# Altium project SaraKit_MainBoard.PrjPcb (part 1 of 3)
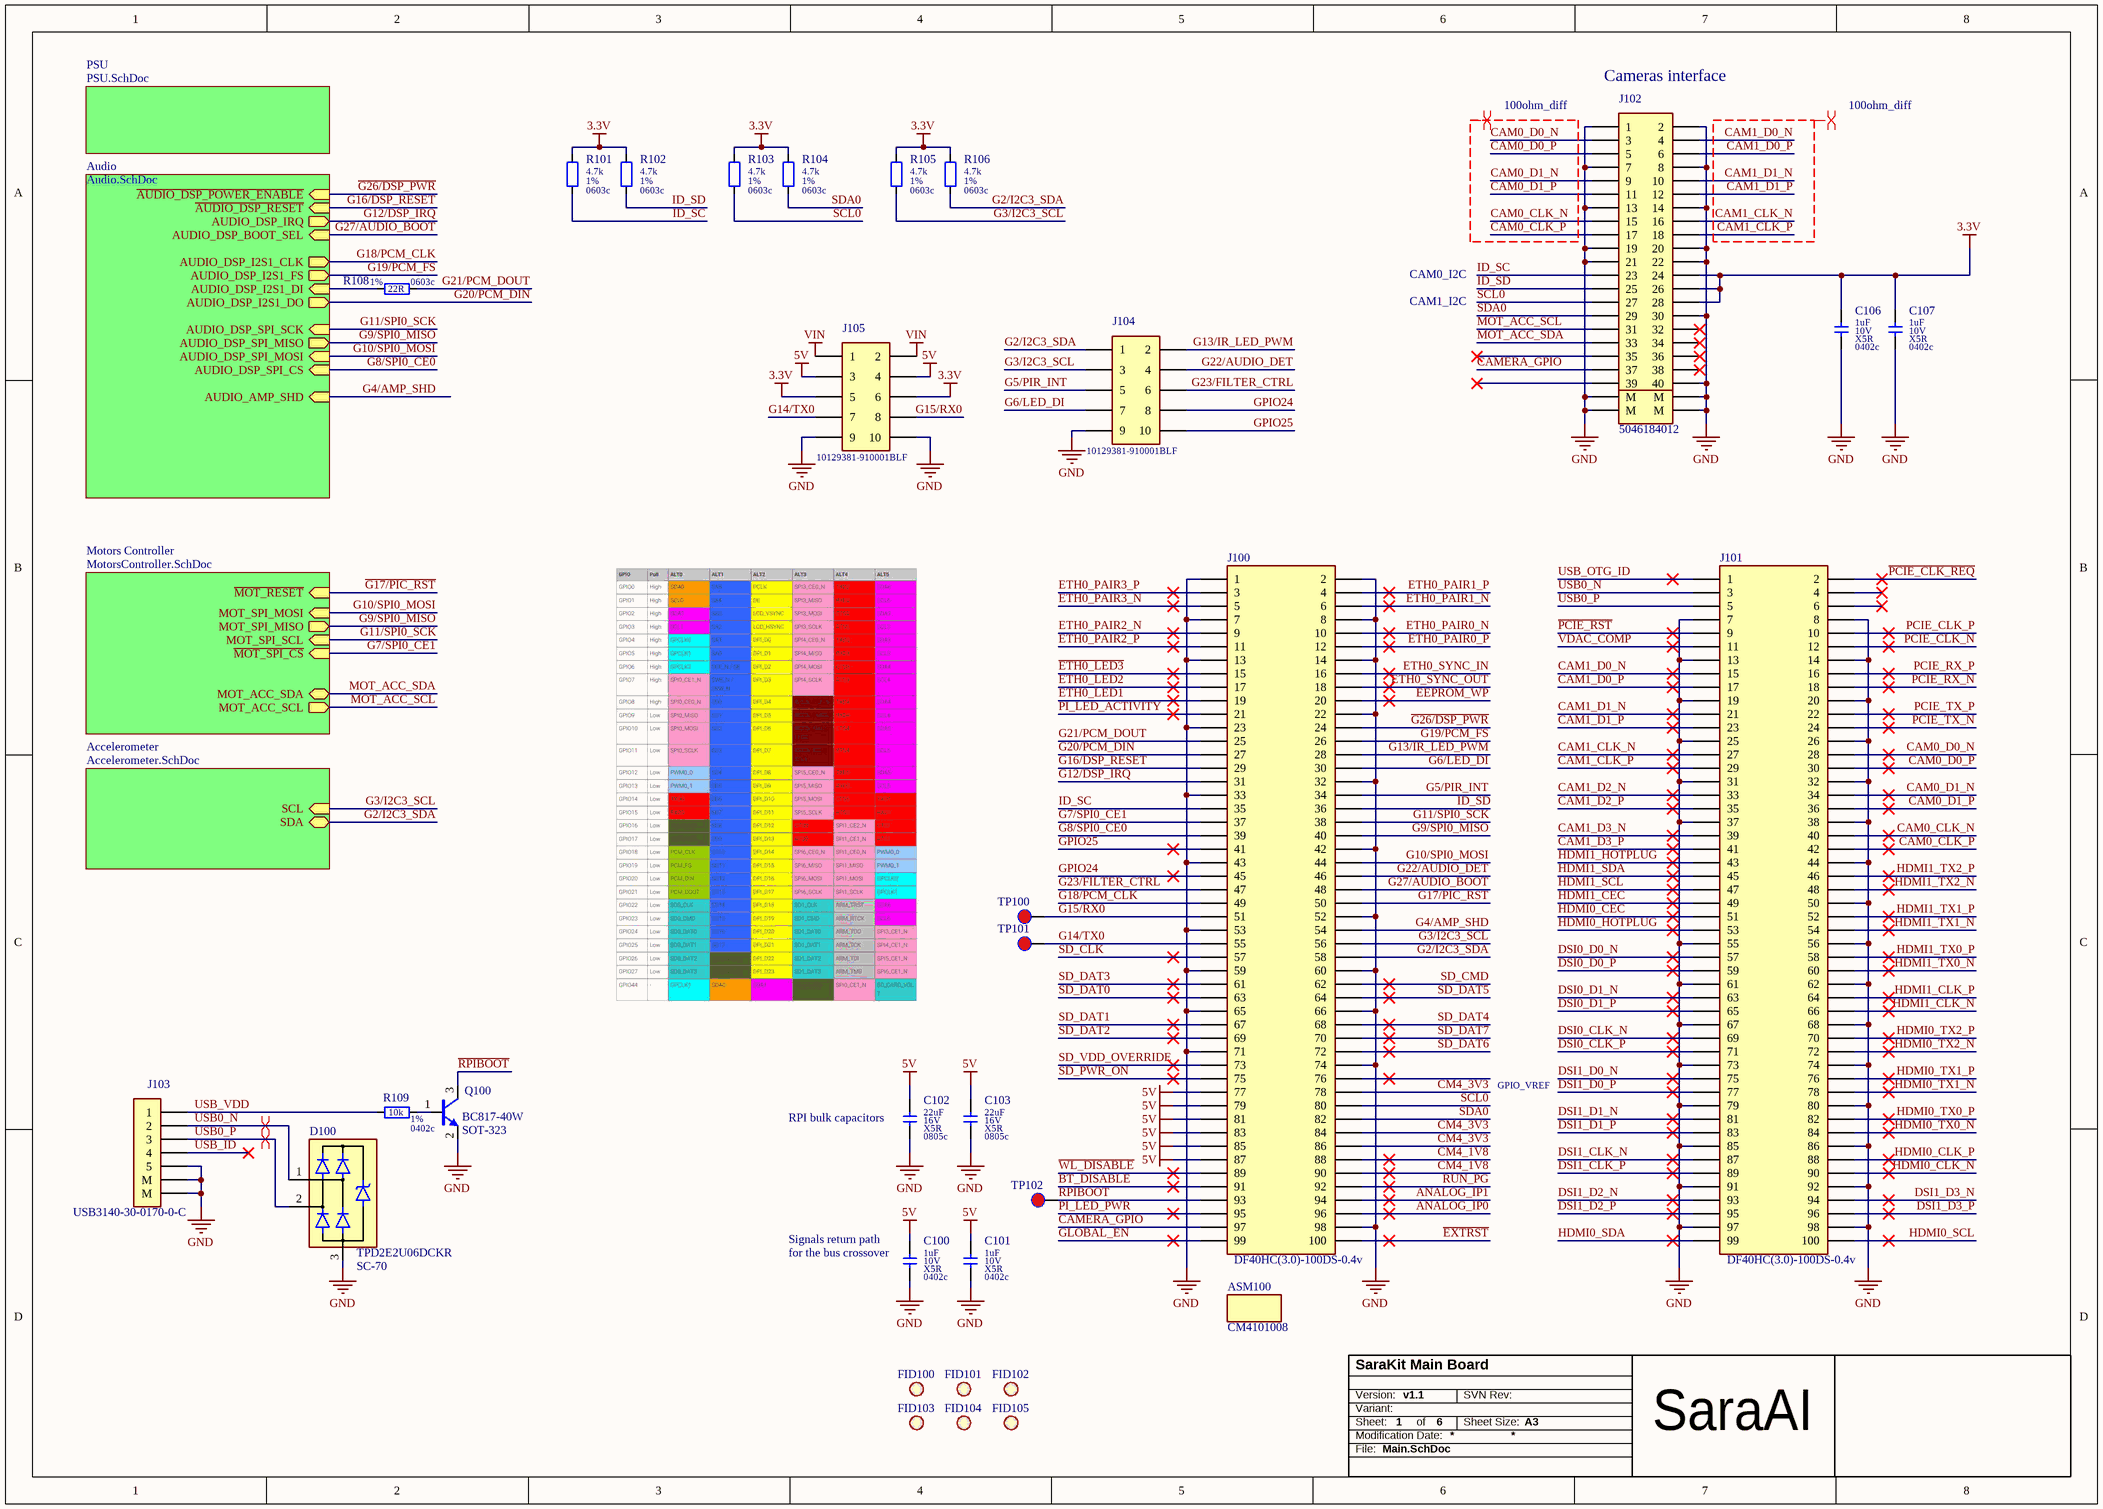
[diagram p0: Main.SchDoc]
Version: v1.1; Project_Code: SaraKit Main Board
6 sheets, 214 parts. Net scope: hierarchical (ports join the sheet entries above them; power ports are global).
Board file: pcb.PcbDoc
Sheets:
  Main.SchDoc
    Audio = Audio.SchDoc
      Speaker Driver = Audio_SpeakerDriver.SchDoc
    Motors Controller = MotorsController.SchDoc
    PSU = PSU.SchDoc
    Accelerometer = Accelerometer.SchDoc

## Sheet Main.SchDoc
size A3; SheetNumber: 1; SheetTotal: 6

### Parts
ASM100  CM4101008  [RASPBERRY PI CM4 EMMC]
C100  11 Parameter 4: X5R  07 Package: 0402c  08 Parameter 1: 1uF  09 Parameter 2: 10V  [CAPC1005X60L]  (hidden comment: CL05A105KP5NNNC)
C101  11 Parameter 4: X5R  07 Package: 0402c  08 Parameter 1: 1uF  09 Parameter 2: 10V  [CAPC1005X60L]  (hidden comment: CL05A105KP5NNNC)
C102  11 Parameter 4: X5R  07 Package: 0805c  08 Parameter 1: 22uF  09 Parameter 2: 16V  [CAPC2013X145L]  (hidden comment: CL21A226MOQNNNE)
C103  11 Parameter 4: X5R  07 Package: 0805c  08 Parameter 1: 22uF  09 Parameter 2: 16V  [CAPC2013X145L]  (hidden comment: CL21A226MOQNNNE)
C106  11 Parameter 4: X5R  07 Package: 0402c  08 Parameter 1: 1uF  09 Parameter 2: 10V  [CAPC1005X60L]  (hidden comment: CL05A105KP5NNNC)
C107  11 Parameter 4: X5R  07 Package: 0402c  08 Parameter 1: 1uF  09 Parameter 2: 10V  [CAPC1005X60L]  (hidden comment: CL05A105KP5NNNC)
D100  07 Package: SC-70  [SOT65P210X110-3L]  (hidden comment: TPD2E2U06DCKR)
FID100  FIDUCIAL  [FIDUCIAL 2MM]  (value not drawn)  (no BOM)
FID101  FIDUCIAL  [FIDUCIAL 2MM]  (value not drawn)  (no BOM)
FID102  FIDUCIAL  [FIDUCIAL 2MM]  (value not drawn)  (no BOM)
FID103  FIDUCIAL  [FIDUCIAL 2MM]  (value not drawn)  (no BOM)
FID104  FIDUCIAL  [FIDUCIAL 2MM]  (value not drawn)  (no BOM)
FID105  FIDUCIAL  [FIDUCIAL 2MM]  (value not drawn)  (no BOM)
J100  DF40HC(3.0)-100DS-0.4v  [DF40HC(3.0)-100DS-0.4V]
J101  DF40HC(3.0)-100DS-0.4v  [DF40HC(3.0)-100DS-0.4V]
J102  5046184012  [MOLEX 5046184012]
J103  USB3140-30-0170-0-C  [USB3140-30-0170-0-C]
J104  10129381-910001BLF  [Goldpin 2.54 2x5]
J105  10129381-910001BLF  [Goldpin 2.54 2x5]
Q100  07 Package: SOT-323  [SOT65P210X110-3L]  (hidden comment: BC817-40W)
R101  07 Package: 0603c  09 Parameter 2: 1%  08 Parameter 1: 4.7k  [RESC1608X55L]  (hidden comment: RC0603FR-074K7L)
R102  07 Package: 0603c  09 Parameter 2: 1%  08 Parameter 1: 4.7k  [RESC1608X55L]  (hidden comment: RC0603FR-074K7L)
R103  07 Package: 0603c  09 Parameter 2: 1%  08 Parameter 1: 4.7k  [RESC1608X55L]  (hidden comment: RC0603FR-074K7L)
R104  07 Package: 0603c  09 Parameter 2: 1%  08 Parameter 1: 4.7k  [RESC1608X55L]  (hidden comment: RC0603FR-074K7L)
R105  07 Package: 0603c  09 Parameter 2: 1%  08 Parameter 1: 4.7k  [RESC1608X55L]  (hidden comment: RC0603FR-074K7L)
R106  07 Package: 0603c  09 Parameter 2: 1%  08 Parameter 1: 4.7k  [RESC1608X55L]  (hidden comment: RC0603FR-074K7L)
R108  07 Package: 0603c  09 Parameter 2: 1%  08 Parameter 1: 22R  [RESC1608X55L]  (hidden comment: RC0603FR-0722RL)
R109  07 Package: 0402c  09 Parameter 2: 1%  08 Parameter 1: 10k  [RESC1005X40L]  (hidden comment: RC0402FR-0710KL)
TP100  TESTPAD  [TP 1.2mm]  (value not drawn)  (no BOM)
TP101  TESTPAD  [TP 1.2mm]  (value not drawn)  (no BOM)
TP102  TESTPAD  [TP 1.2mm]  (value not drawn)  (no BOM)

### Sub-sheets
Accelerometer = Accelerometer.SchDoc: SCL (in), SDA (bidir)
Audio = Audio.SchDoc: AUDIO_DSP_I2S1_CLK (out), AUDIO_DSP_I2S1_FS (out), AUDIO_DSP_I2S1_DI (in), AUDIO_DSP_I2S1_DO (out), AUDIO_DSP_SPI_SCK (in), AUDIO_DSP_SPI_CS (in), AUDIO_AMP_SHD (in), AUDIO_DSP_SPI_MISO (out), AUDIO_DSP_SPI_MOSI (in), ~{AUDIO_DSP_RESET} (in), AUDIO_DSP_BOOT_SEL (in), AUDIO_DSP_IRQ (out), ~{AUDIO_DSP_POWER_ENABLE} (in)
Motors Controller = MotorsController.SchDoc: MOT_ACC_SDA (bidir), MOT_ACC_SCL (out), ~{MOT_RESET} (in), MOT_SPI_SCL (in), ~{MOT_SPI_CS} (in), MOT_SPI_MOSI (in), MOT_SPI_MISO (out)
PSU = PSU.SchDoc: no entries

### Nets
3.3V: C106.2 C107.2 J102.24 J102.26 J102.28 J105.5 J105.6 R101.2 R102.2 R103.2 R104.2 R105.2 R106.2
5V: C100.2 C101.2 C102.2 C103.2 J100.77 J100.79 J100.81 J100.83 J100.85 J100.87 J105.3 J105.4
GND: C100.1 C101.1 C102.1 C103.1 C106.1 C107.1 D100.3 J100.1 J100.2 J100.7 J100.8 J100.13 J100.14 J100.22 J100.23 J100.32 J100.33 J100.42 J100.43 J100.52 J100.53 J100.59 J100.60 J100.65 J100.66 J100.71 J100.74 J100.98 J101.7 J101.8 J101.13 J101.14 J101.19 J101.20 J101.25 J101.26 J101.31 J101.32 J101.37 J101.38 J101.44 J101.50 J101.55 J101.56 J101.61 J101.62 J101.67 J101.68 J101.73 J101.74 J101.79 J101.80 J101.85 J101.86 J101.91 J101.92 J101.97 J101.98 J102.1 J102.2 J102.7 J102.8 J102.13 J102.14 J102.19 J102.20 J102.21 J102.22 J102.30 J102.40 J102.41(M) J102.42(M) J102.43(M) J102.44(M) J103.5 J103.MNT1(M) J103.MNT2(M) J104.9 J105.9 J105.10 Q100.2(E)
VIN: J105.1 J105.2
~{BT_DISABLE}: J100.91
~{EEPROM_WP}: J100.20
~{ETH0_LED1}: J100.19
~{ETH0_LED2}: J100.17
~{ETH0_LED3}: J100.15
~{EXTRST}: J100.100
~{G7/SPI0_CE1}: J100.37 ; sheet Motors Controller/~{MOT_SPI_CS}
~{G8/SPI0_CE0}: J100.39 ; sheet Audio/AUDIO_DSP_SPI_CS
~{G16/DSP_RESET}: J100.29 ; sheet Audio/~{AUDIO_DSP_RESET}
~{G17/PIC_RST}: J100.50 ; sheet Motors Controller/~{MOT_RESET}
~{G26/DSP_PWR}: J100.24 ; sheet Audio/~{AUDIO_DSP_POWER_ENABLE}
~{PCIE_CLK_REQ}: J101.2
~{PCIE_RST}: J101.9
~{PI_LED_ACTIVITY}: J100.21
~{PI_LED_PWR}: J100.95
~{RPIBOOT}: J100.93 Q100.3(C) TP102.1
~{WL_DISABLE}: J100.89
ANALOG_IP0: J100.96
ANALOG_IP1: J100.94
AUDIO_DSP_I2S1_DI: R108.1 ; sheet Audio/AUDIO_DSP_I2S1_DI
CAM0_CLK_N: J101.40 J102.15
CAM0_CLK_P: J101.42 J102.17
CAM0_D0_N: J101.28 J102.3
CAM0_D0_P: J101.30 J102.5
CAM0_D1_N: J101.34 J102.9
CAM0_D1_P: J101.36 J102.11
CAM1_CLK_N: J101.27 J102.16
CAM1_CLK_P: J101.29 J102.18
CAM1_D0_N: J101.15 J102.4
CAM1_D0_P: J101.17 J102.6
CAM1_D1_N: J101.21 J102.10
CAM1_D1_P: J101.23 J102.12
CAM1_D2_N: J101.33
CAM1_D2_P: J101.35
CAM1_D3_N: J101.39
CAM1_D3_P: J101.41
CAMERA_GPIO: J100.97 J102.37
CM4_1V8: J100.88 J100.90
CM4_3V3: J100.78 J100.84 J100.86
DSI0_CLK_N: J101.69
DSI0_CLK_P: J101.71
DSI0_D0_N: J101.57
DSI0_D0_P: J101.59
DSI0_D1_N: J101.63
DSI0_D1_P: J101.65
DSI1_CLK_N: J101.87
DSI1_CLK_P: J101.89
DSI1_D0_N: J101.75
DSI1_D0_P: J101.77
DSI1_D1_N: J101.81
DSI1_D1_P: J101.83
DSI1_D2_N: J101.93
DSI1_D2_P: J101.95
DSI1_D3_N: J101.94
DSI1_D3_P: J101.96
ETH0_PAIR0_N: J100.10
ETH0_PAIR0_P: J100.12
ETH0_PAIR1_N: J100.6
ETH0_PAIR1_P: J100.4
ETH0_PAIR2_N: J100.9
ETH0_PAIR2_P: J100.11
ETH0_PAIR3_N: J100.5
ETH0_PAIR3_P: J100.3
ETH0_SYNC_IN: J100.16
ETH0_SYNC_OUT: J100.18
G2/I2C3_SDA: J100.58 J104.1 R106.1 ; sheet Accelerometer/SDA
G3/I2C3_SCL: J100.56 J104.3 R105.1 ; sheet Accelerometer/SCL
G4/AMP_SHD: J100.54 ; sheet Audio/AUDIO_AMP_SHD
G5/PIR_INT: J100.34 J104.5
G6/LED_DI: J100.30 J104.7
G9/SPI0_MISO: J100.40 ; sheet Audio/AUDIO_DSP_SPI_MISO, sheet Motors Controller/MOT_SPI_MISO
G10/SPI0_MOSI: J100.44 ; sheet Audio/AUDIO_DSP_SPI_MOSI, sheet Motors Controller/MOT_SPI_MOSI
G11/SPI0_SCK: J100.38 ; sheet Audio/AUDIO_DSP_SPI_SCK, sheet Motors Controller/MOT_SPI_SCL
G12/DSP_IRQ: J100.31 ; sheet Audio/AUDIO_DSP_IRQ
G13/IR_LED_PWM: J100.28 J104.2
G14/TX0: J100.55 J105.7 TP101.1
G15/RX0: J100.51 J105.8 TP100.1
G18/PCM_CLK: J100.49 ; sheet Audio/AUDIO_DSP_I2S1_CLK
G19/PCM_FS: J100.26 ; sheet Audio/AUDIO_DSP_I2S1_FS
G20/PCM_DIN: J100.27 ; sheet Audio/AUDIO_DSP_I2S1_DO
G21/PCM_DOUT: J100.25 R108.2
G22/AUDIO_DET: J100.46 J104.4
G23/FILTER_CTRL: J100.47 J104.6
G27/AUDIO_BOOT: J100.48 ; sheet Audio/AUDIO_DSP_BOOT_SEL
GLOBAL_EN: J100.99
GPIO24: J100.45 J104.8
GPIO25: J100.41 J104.10
HDMI0_CEC: J101.51
HDMI0_CLK_N: J101.90
HDMI0_CLK_P: J101.88
HDMI0_HOTPLUG: J101.53
HDMI0_SCL: J101.100
HDMI0_SDA: J101.99
HDMI0_TX0_N: J101.84
HDMI0_TX0_P: J101.82
HDMI0_TX1_N: J101.78
HDMI0_TX1_P: J101.76
HDMI0_TX2_N: J101.72
HDMI0_TX2_P: J101.70
HDMI1_CEC: J101.49
HDMI1_CLK_N: J101.66
HDMI1_CLK_P: J101.64
HDMI1_HOTPLUG: J101.43
HDMI1_SCL: J101.47
HDMI1_SDA: J101.45
HDMI1_TX0_N: J101.60
HDMI1_TX0_P: J101.58
HDMI1_TX1_N: J101.54
HDMI1_TX1_P: J101.52
HDMI1_TX2_N: J101.48
HDMI1_TX2_P: J101.46
ID_SC: J100.35 J102.23 R101.1
ID_SD: J100.36 J102.25 R102.1
MOT_ACC_SCL: J102.31 ; sheet Motors Controller/MOT_ACC_SCL
MOT_ACC_SDA: J102.33 ; sheet Motors Controller/MOT_ACC_SDA
PCIE_CLK_N: J101.12
PCIE_CLK_P: J101.10
PCIE_RX_N: J101.18
PCIE_RX_P: J101.16
PCIE_TX_N: J101.24
PCIE_TX_P: J101.22
RUN_PG: J100.92
SCL0: J100.80 J102.27 R103.1
SD_CLK: J100.57
SD_CMD: J100.62
SD_DAT0: J100.63
SD_DAT1: J100.67
SD_DAT2: J100.69
SD_DAT3: J100.61
SD_DAT4: J100.68
SD_DAT5: J100.64
SD_DAT6: J100.72
SD_DAT7: J100.70
SD_PWR_ON: J100.75
SD_VDD_OVERRIDE: J100.73
SDA0: J100.82 J102.29 R104.1
USB0_N: D100.1 J101.3 J103.2
USB0_P: D100.2 J101.5 J103.3
USB_ID: J103.4
USB_OTG_ID: J101.1
USB_VDD: J103.1 R109.2
VDAC_COMP: J101.11
NetQ100_1: Q100.1(B) R109.1

Not connected (* = marked no-connect by the designer): J100 76*; J101 4* 6*; J102 32* 34* 35* 36* 38* 39*

### Layout directives
differential pair; differential pair class 100ohm_diff: CAM0_CLK_N, CAM0_CLK_P, CAM0_D0_N, CAM0_D0_P, CAM0_D1_N, CAM0_D1_P, CAM1_CLK_N, CAM1_CLK_P, CAM1_D0_N, CAM1_D0_P, CAM1_D1_N, CAM1_D1_P
differential pair; differential pair class USB: USB0_N, USB0_P

### Notes on the sheet
- (near J102) Cameras interface
- CAM0_I2C
- CAM1_I2C
- (near C102) RPI bulk capacitors
- GPIO_VREF
- (near C100) Signals return path
- (near C100) for the bus crossover
- Version:
- SVN Rev:
- Sheet:
- File:
- Modification Date:
- Variant:
- of
- Sheet Size:
- A3
- SaraAI

### Library data of the parts
ASM100 = 439: FAS SoM 1GB 8GB; 03 Manufacturer: Raspberry Pi; 00 Index: 439; 01 Name: IC PROCESSOR CM4101008 Raspberry Pi; 04 Main Group: IC; 05 Sub Group: PROCESSOR; 06 Assembly: FAS; 11 Parameter 4: SoM; 12 Parameter 5: 1GB; 13 Parameter 6: 8GB; 14 Modification Date: 08.02.2021; ComponentLink1Description: DATASHEET; ComponentLink1URL: https://datasheets.raspberrypi.org/cm4/cm4-datasheet.pdf; 02 MPN: CM4101008
C100 C101 C106 C107 = 154: SMT 0402c 1uF 10V 10% X5R 10.2MHz 85'C; 03 Manufacturer: Samsung; 00 Index: 154; 01 Name: CAPACITOR THICK FILM CL05A105KP5NNNC Samsung; 05 Sub Group: THICK FILM; 04 Main Group: CAPACITOR; 06 Assembly: SMT; 12 Parameter 5: 10.2MHz; 13 Parameter 6: 85'C; 14 Modification Date: 16.11.2020; ComponentLink1Description: DATASHEET; ComponentLink1URL: E:\Praca\Mindsailors\Mindsailors Altium\Database Library\Datasheets\CAPACITOR\Samsung CL05A105KP5NNNC.pdf; 02 MPN: CL05A105KP5NNNC; 10 Parameter 3: 10%
C102 C103 = 81: SMT 0805c 22uF 16V 20% X5R 1.6MHz 85'C; 03 Manufacturer: Samsung; 00 Index: 81; 01 Name: CAPACITOR CERAMIC CL21A226MOQNNNE Samsung; 05 Sub Group: CERAMIC; 04 Main Group: CAPACITOR; 06 Assembly: SMT; 12 Parameter 5: 1.6MHz; 13 Parameter 6: 85'C; 14 Modification Date: 16.11.2020; ComponentLink1Description: DATASHEET; ComponentLink1URL: E:\Praca\Mindsailors\Mindsailors Altium\Database Library\Datasheets\CAPACITOR\Samsung CL21A226MOQNNN.pdf; 02 MPN: CL21A226MOQNNNE; 10 Parameter 3: 20%
D100 = 445: SMT SC-70 6.5V 5.5A 85W Bidirectional 12.4V 10nA; 03 Manufacturer: Texas Instruments; 00 Index: 445; 01 Name: DIODE TVS/ESD TPD2E2U06DCKR Texas Instruments; 04 Main Group: DIODE; 05 Sub Group: TVS/ESD; Library Directory: sym_basics/; Fotprint Directory: fot_ipc/; 06 Assembly: SMT; 11 Parameter 4: Bidirectional; 12 Parameter 5: 12.4V; 13 Parameter 6: 10nA; 14 Modification Date: 10.02.2021; ComponentLink1Description: DATASHEET; ComponentLink1URL: https://www.ti.com/lit/ds/symlink/tpd2e2u06.pdf?ts=1612947447411&ref_url=https%253A%252F%252Fwww.ti.com%252Fsitesearch%252Fdocs%252Funiversalsearch.tsp%253FsearchTerm%253DTPD2E2U06; 10 Parameter 3: 85W; 09 Parameter 2: 5.5A; 08 Parameter 1: 6.5V; 02 MPN: TPD2E2U06DCKR
FID100-FID105 = 487: 00 Index: 487; 01 Name: FIDUCIAL; 14 Modification Date: 23.01.2021; 02 MPN: FIDUCIAL; 07 Package: *
J100 J101 = 440: SMT 2x50 0.4mm Female Straight; 03 Manufacturer: Hirose; 00 Index: 440; 01 Name: CONNECTOR PCB DF40HC(3.0)-100DS-0.4v Hirose; 04 Main Group: CONNECTOR; 05 Sub Group: PCB; 06 Assembly: SMT; 14 Modification Date: 08.02.2021; ComponentLink1Description: DATASHEET; ComponentLink1URL: https://www.hirose.com/en/product/document?clcode=CL0684-4151-0-51&productname=DF40HC(3.0)-100DS-0.4V(51&series=DF40&documenttype=2DDrawing&lang=en&documentid=0001001369; 10 Parameter 3: Female; 09 Parameter 2: 0.4mm; 08 Parameter 1: 2x50; 11 Parameter 4: Straight; 02 MPN: DF40HC(3.0)-100DS-0.4v; 07 Package: *
J102 = 509: SMT 2x20 0.35mm Straight 50V 0.3A; 03 Manufacturer: Molex; 00 Index: 509; 01 Name: CONNECTOR PCB 5046184012 Molex; 04 Main Group: CONNECTOR; 05 Sub Group: PCB; 06 Assembly: SMT; 13 Parameter 6: 0.3A; 14 Modification Date: 18.03.2021; ComponentLink1Description: DATASHEET; ComponentLink1URL: https://www.molex.com/molex/products/part-detail/pcb_receptacles/5046183012; 09 Parameter 2: 0.35mm; 08 Parameter 1: 2x20; 11 Parameter 4: Straight; 12 Parameter 5: 50V; 07 Package: *; 02 MPN: 5046184012
J103 = 980: SMD/THT USB 0.65mm Straight 30V 1A; 03 Manufacturer: GCT; 00 Index: 980; 01 Name: CONNECTOR WIRE USB3140-30-0170-0-C GCT; 04 Main Group: CONNECTOR; 05 Sub Group: WIRE; Library Directory: sym_basics/; Fotprint Directory: fot_other/; 06 Assembly: SMD/THT; 13 Parameter 6: 1A; 14 Modification Date: 05.01.2022; ComponentLink1Description: DATASHEET; ComponentLink1URL: https://pl.mouser.com/datasheet/2/837/USB3140-1948849.pdf; 09 Parameter 2: 0.65mm; 08 Parameter 1: USB; 11 Parameter 4: Straight; 12 Parameter 5: 30V; 07 Package: *; 02 MPN: USB3140-30-0170-0-C
J104 J105 = 981: THT 2X5 2.54mm Straight 110V 3A; 03 Manufacturer: Amphenol; 00 Index: 981; 01 Name: CONNECTOR WIRE 10129381-910001BLF Amphenol; 04 Main Group: CONNECTOR; 05 Sub Group: WIRE; Library Directory: sym_basics/; Fotprint Directory: fot_other/; 06 Assembly: THT; 13 Parameter 6: 3A; 14 Modification Date: 05.01.2022; ComponentLink1Description: DATASHEET; ComponentLink1URL: https://www.amphenol-icc.com/econostik-10129381910001blf.html; 09 Parameter 2: 2.54mm; 08 Parameter 1: 2X5; 11 Parameter 4: Straight; 12 Parameter 5: 110V; 07 Package: *; 02 MPN: 10129381-910001BLF
Q100 = 93: SMT SOT-323 NPN 45V 0.5A 0.2W; 03 Manufacturer: Nexperia; 00 Index: 93; 01 Name: TRANSISTOR BIPOLAR BC817-40W Nexperia; 04 Main Group: TRANSISTOR; 05 Sub Group: BIPOLAR; Library Directory: sym_basics/; Fotprint Directory: fot_ipc/; 06 Assembly: SMT; 13 Parameter 6: 0.2W; 14 Modification Date: 16.11.2020; ComponentLink1Description: DATASHEET; ComponentLink1URL: E:\Praca\Mindsailors\Mindsailors Altium\Database Library\Datasheets\TRANSISTOR\Nexperia BC817W Series.pdf; 08 Parameter 1: NPN; 11 Parameter 4: 45V; 12 Parameter 5: 0.5A; 02 MPN: BC817-40W
R101-R106 = 380: SMT 0603c 4.7k 1% 100mW 100ppm/K 75V; 03 Manufacturer: Yageo; 00 Index: 380; 01 Name: RESISTOR THICK FILM RC0603FR-074K7L Yageo; 05 Sub Group: THICK FILM; 04 Main Group: RESISTOR; 06 Assembly: SMT; 11 Parameter 4: 100ppm/K; 12 Parameter 5: 75V; 14 Modification Date: 25.01.2021; ComponentLink1Description: DATASHEET; ComponentLink1URL: https://www.yageo.com/upload/media/product/products/datasheet/rchip/PYu-RC_Group_51_RoHS_L_11.pdf; 10 Parameter 3: 100mW; 02 MPN: RC0603FR-074K7L
R108 = 318: SMT 0603c 22R 1% 100mW 100ppm/K 75V; 03 Manufacturer: Yageo; 00 Index: 318; 01 Name: RESISTOR THICK FILM RC0603FR-0722RL Yageo; 05 Sub Group: THICK FILM; Library Directory: sym_basics/; Fotprint Directory: fot_ipc/; 04 Main Group: RESISTOR; 06 Assembly: SMT; 11 Parameter 4: 100ppm/K; 12 Parameter 5: 75V; 14 Modification Date: 25.01.2021; ComponentLink1Description: DATASHEET; ComponentLink1URL: https://www.yageo.com/upload/media/product/products/datasheet/rchip/PYu-RC_Group_51_RoHS_L_11.pdf; 10 Parameter 3: 100mW; 02 MPN: RC0603FR-0722RL
R109 = 15: SMT 0402c 10k 1% 62.5mW 100ppm/K 50V; 03 Manufacturer: Yageo; 00 Index: 15; 01 Name: RESISTOR THICK FILM RC0402FR-0710KL Yageo; 05 Sub Group: THICK FILM; 04 Main Group: RESISTOR; 06 Assembly: SMT; 11 Parameter 4: 100ppm/K; 12 Parameter 5: 50V; 14 Modification Date: 16.11.2020; ComponentLink1Description: DATASHEET; ComponentLink1URL: E:\Praca\Mindsailors\Mindsailors Altium\Database Library\Datasheets\RESISTOR\Yageo RC_L Series.pdf; 10 Parameter 3: 62.5mW; 02 MPN: RC0402FR-0710KL
TP100 = 10: 00 Index: 10; 01 Name: PCB COMPONENT TESTPAD TESTPAD; 04 Main Group: PCB COMPONENT; Library Directory: sym_basics/; Fotprint Directory: fot_other/; 02 MPN: TESTPAD; 05 Sub Group: TESTPAD; 14 Modification Date: 16.11.2020
TP101 TP102 = 10: 00 Index: 10; 01 Name: PCB COMPONENT TESTPAD TESTPAD; 04 Main Group: PCB COMPONENT; 02 MPN: TESTPAD; 05 Sub Group: TESTPAD; 14 Modification Date: 16.11.2020

## Sheet Audio.SchDoc
size A3; SheetNumber: 2; SheetTotal: 6
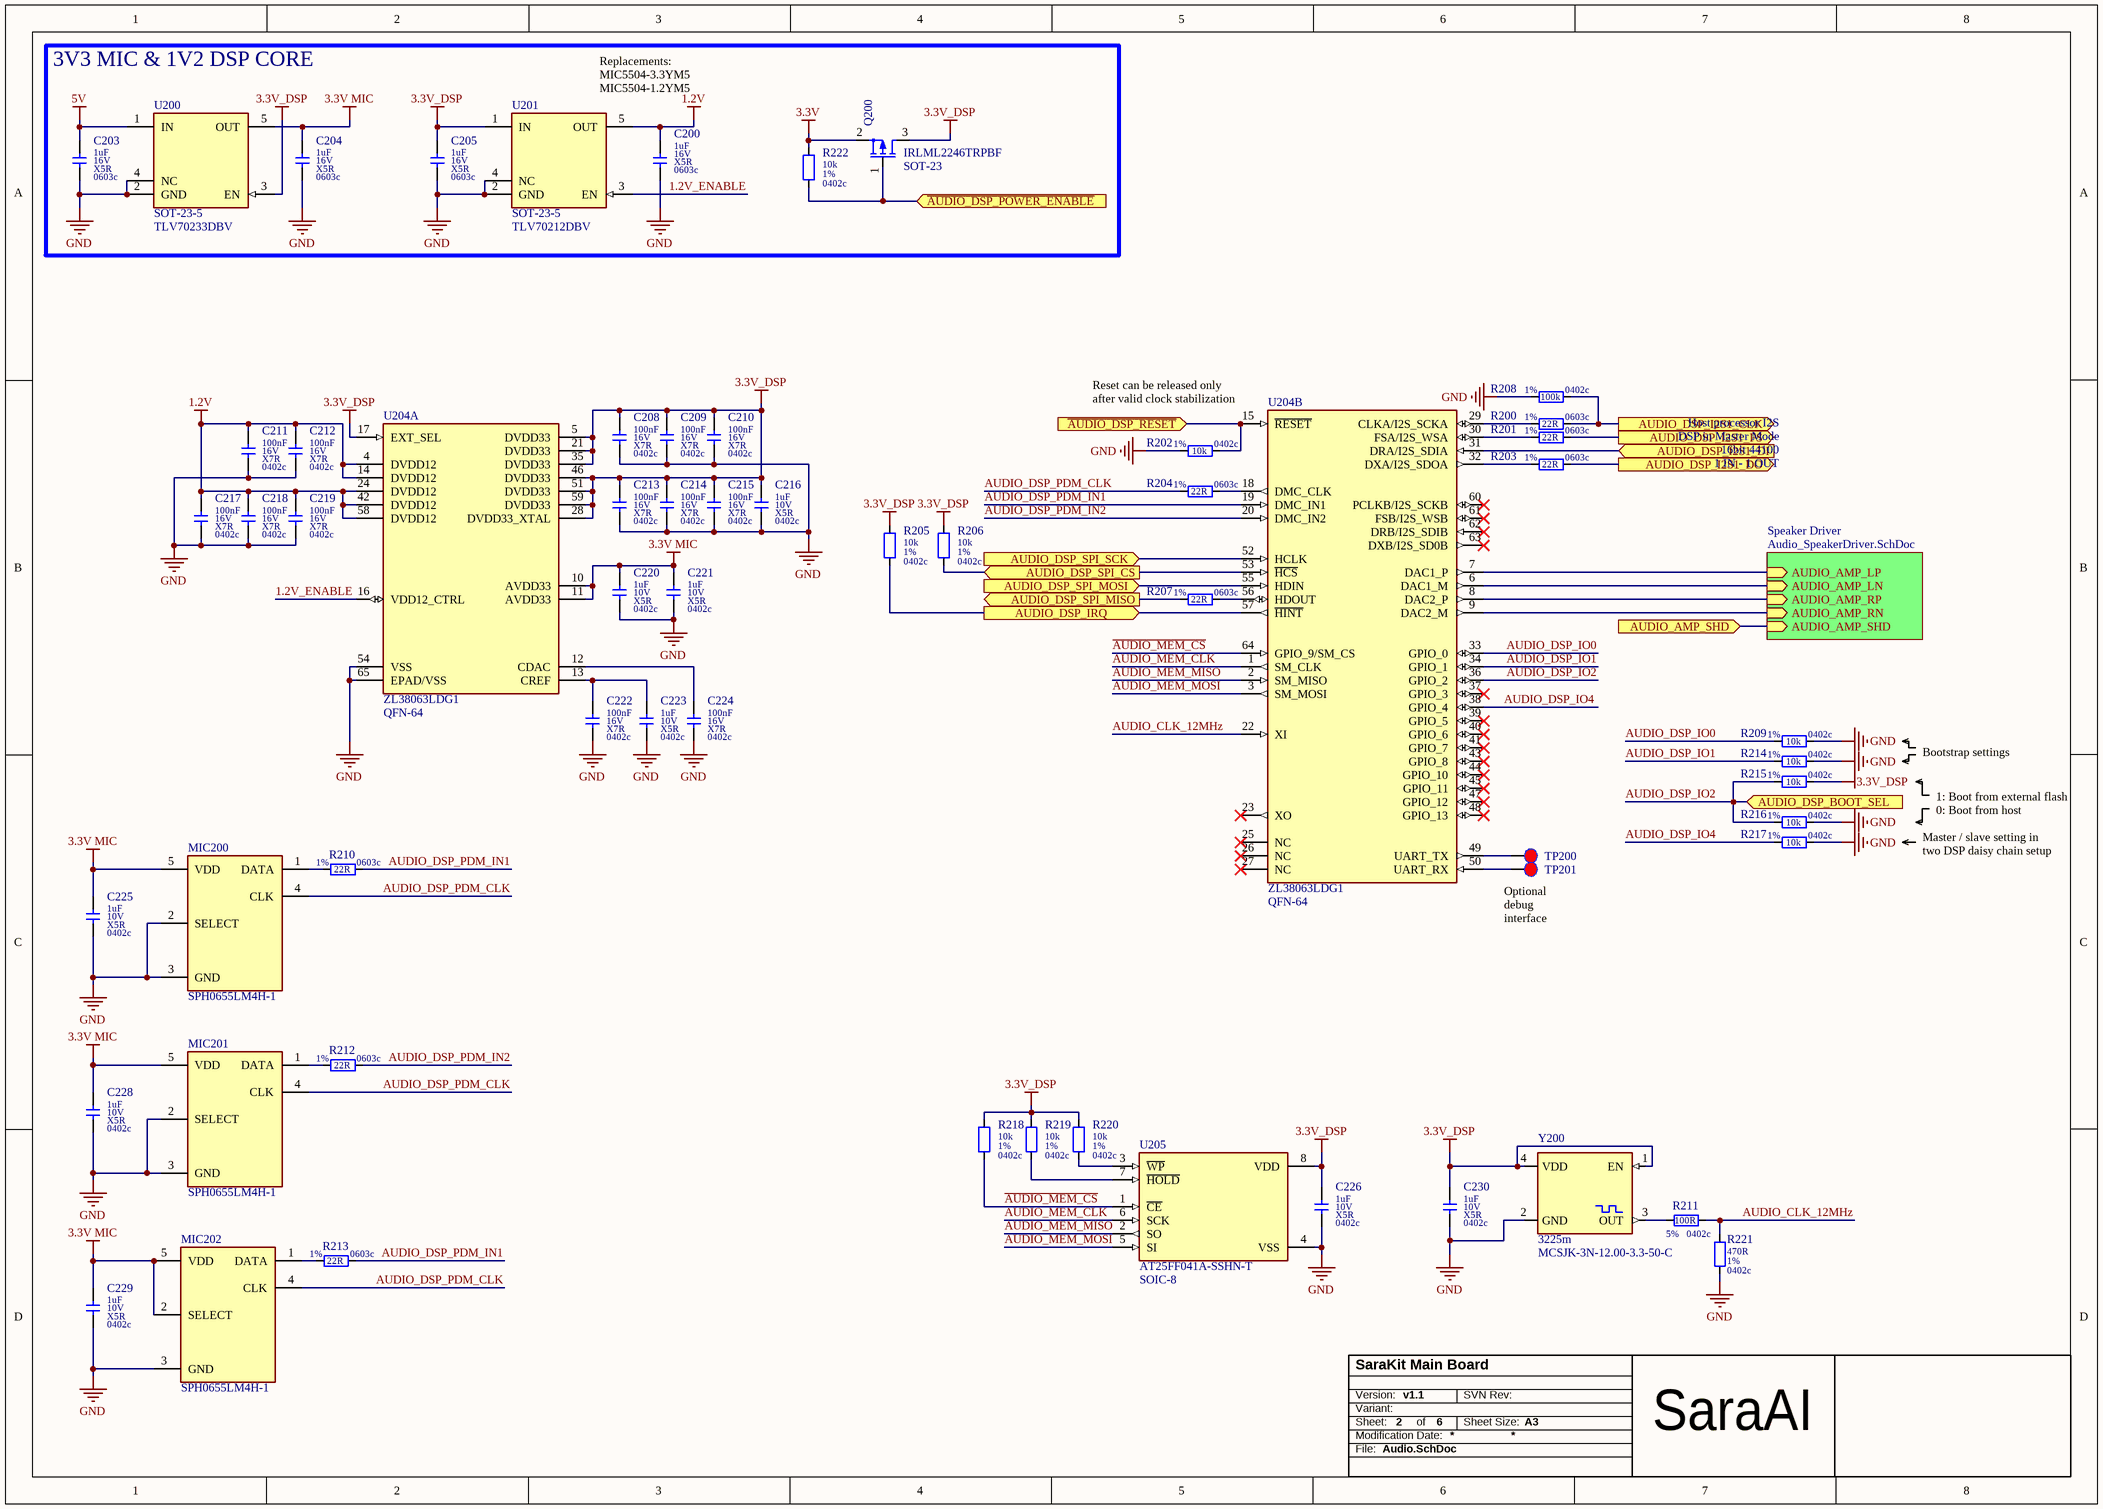
[diagram p1: Audio.SchDoc]

### Parts
C200  11 Parameter 4: X5R  07 Package: 0603c  08 Parameter 1: 1uF  09 Parameter 2: 16V  [CAPC1608X90L]  (hidden comment: CL10A105KO8NNNC)
C203  11 Parameter 4: X5R  07 Package: 0603c  08 Parameter 1: 1uF  09 Parameter 2: 16V  [CAPC1608X90L]  (hidden comment: CL10A105KO8NNNC)
C204  11 Parameter 4: X5R  07 Package: 0603c  08 Parameter 1: 1uF  09 Parameter 2: 16V  [CAPC1608X90L]  (hidden comment: CL10A105KO8NNNC)
C205  11 Parameter 4: X5R  07 Package: 0603c  08 Parameter 1: 1uF  09 Parameter 2: 16V  [CAPC1608X90L]  (hidden comment: CL10A105KO8NNNC)
C208  11 Parameter 4: X7R  07 Package: 0402c  08 Parameter 1: 100nF  09 Parameter 2: 16V  [CAPC1005X60L]  (hidden comment: CL05B104KO5NNNC)
C209  11 Parameter 4: X7R  07 Package: 0402c  08 Parameter 1: 100nF  09 Parameter 2: 16V  [CAPC1005X60L]  (hidden comment: CL05B104KO5NNNC)
C210  11 Parameter 4: X7R  07 Package: 0402c  08 Parameter 1: 100nF  09 Parameter 2: 16V  [CAPC1005X60L]  (hidden comment: CL05B104KO5NNNC)
C211  11 Parameter 4: X7R  07 Package: 0402c  08 Parameter 1: 100nF  09 Parameter 2: 16V  [CAPC1005X60L]  (hidden comment: CL05B104KO5NNNC)
C212  11 Parameter 4: X7R  07 Package: 0402c  08 Parameter 1: 100nF  09 Parameter 2: 16V  [CAPC1005X60L]  (hidden comment: CL05B104KO5NNNC)
C213  11 Parameter 4: X7R  07 Package: 0402c  08 Parameter 1: 100nF  09 Parameter 2: 16V  [CAPC1005X60L]  (hidden comment: CL05B104KO5NNNC)
C214  11 Parameter 4: X7R  07 Package: 0402c  08 Parameter 1: 100nF  09 Parameter 2: 16V  [CAPC1005X60L]  (hidden comment: CL05B104KO5NNNC)
C215  11 Parameter 4: X7R  07 Package: 0402c  08 Parameter 1: 100nF  09 Parameter 2: 16V  [CAPC1005X60L]  (hidden comment: CL05B104KO5NNNC)
C216  11 Parameter 4: X5R  07 Package: 0402c  08 Parameter 1: 1uF  09 Parameter 2: 10V  [CAPC1005X60L]  (hidden comment: CL05A105KP5NNNC)
C217  11 Parameter 4: X7R  07 Package: 0402c  08 Parameter 1: 100nF  09 Parameter 2: 16V  [CAPC1005X60L]  (hidden comment: CL05B104KO5NNNC)
C218  11 Parameter 4: X7R  07 Package: 0402c  08 Parameter 1: 100nF  09 Parameter 2: 16V  [CAPC1005X60L]  (hidden comment: CL05B104KO5NNNC)
C219  11 Parameter 4: X7R  07 Package: 0402c  08 Parameter 1: 100nF  09 Parameter 2: 16V  [CAPC1005X60L]  (hidden comment: CL05B104KO5NNNC)
C220  11 Parameter 4: X5R  07 Package: 0402c  08 Parameter 1: 1uF  09 Parameter 2: 10V  [CAPC1005X60L]  (hidden comment: CL05A105KP5NNNC)
C221  11 Parameter 4: X5R  07 Package: 0402c  08 Parameter 1: 1uF  09 Parameter 2: 10V  [CAPC1005X60L]  (hidden comment: CL05A105KP5NNNC)
C222  11 Parameter 4: X7R  07 Package: 0402c  08 Parameter 1: 100nF  09 Parameter 2: 16V  [CAPC1005X60L]  (hidden comment: CL05B104KO5NNNC)
C223  11 Parameter 4: X5R  07 Package: 0402c  08 Parameter 1: 1uF  09 Parameter 2: 10V  [CAPC1005X60L]  (hidden comment: CL05A105KP5NNNC)
C224  11 Parameter 4: X7R  07 Package: 0402c  08 Parameter 1: 100nF  09 Parameter 2: 16V  [CAPC1005X60L]  (hidden comment: CL05B104KO5NNNC)
C225  11 Parameter 4: X5R  07 Package: 0402c  08 Parameter 1: 1uF  09 Parameter 2: 10V  [CAPC1005X60L]  (hidden comment: CL05A105KP5NNNC)
C226  11 Parameter 4: X5R  07 Package: 0402c  08 Parameter 1: 1uF  09 Parameter 2: 10V  [CAPC1005X60L]  (hidden comment: CL05A105KP5NNNC)
C228  11 Parameter 4: X5R  07 Package: 0402c  08 Parameter 1: 1uF  09 Parameter 2: 10V  [CAPC1005X60L]  (hidden comment: CL05A105KP5NNNC)
C229  11 Parameter 4: X5R  07 Package: 0402c  08 Parameter 1: 1uF  09 Parameter 2: 10V  [CAPC1005X60L]  (hidden comment: CL05A105KP5NNNC)
C230  11 Parameter 4: X5R  07 Package: 0402c  08 Parameter 1: 1uF  09 Parameter 2: 10V  [CAPC1005X60L]  (hidden comment: CL05A105KP5NNNC)
MIC200  SPH0655LM4H-1  [KNOWLES SPH0655LM4H-1]
MIC201  SPH0655LM4H-1  [KNOWLES SPH0655LM4H-1]
MIC202  SPH0655LM4H-1  [KNOWLES SPH0655LM4H-1]
Q200  07 Package: SOT-23  [SOT95P240X110-3L]  (hidden comment: IRLML2246TRPBF)
R200  07 Package: 0603c  09 Parameter 2: 1%  08 Parameter 1: 22R  [RESC1608X55L]  (hidden comment: RC0603FR-0722RL)
R201  07 Package: 0603c  09 Parameter 2: 1%  08 Parameter 1: 22R  [RESC1608X55L]  (hidden comment: RC0603FR-0722RL)
R202  07 Package: 0402c  09 Parameter 2: 1%  08 Parameter 1: 10k  [RESC1005X40L]  (hidden comment: RC0402FR-0710KL)
R203  07 Package: 0603c  09 Parameter 2: 1%  08 Parameter 1: 22R  [RESC1608X55L]  (hidden comment: RC0603FR-0722RL)
R204  07 Package: 0603c  09 Parameter 2: 1%  08 Parameter 1: 22R  [RESC1608X55L]  (hidden comment: RC0603FR-0722RL)
R205  07 Package: 0402c  09 Parameter 2: 1%  08 Parameter 1: 10k  [RESC1005X40L]  (hidden comment: RC0402FR-0710KL)
R206  07 Package: 0402c  09 Parameter 2: 1%  08 Parameter 1: 10k  [RESC1005X40L]  (hidden comment: RC0402FR-0710KL)
R207  07 Package: 0603c  09 Parameter 2: 1%  08 Parameter 1: 22R  [RESC1608X55L]  (hidden comment: RC0603FR-0722RL)
R208  07 Package: 0402c  09 Parameter 2: 1%  08 Parameter 1: 100k  [RESC1005X40L]  (hidden comment: RC0402FR-07100KL)
R209  07 Package: 0402c  09 Parameter 2: 1%  08 Parameter 1: 10k  [RESC1005X40L]  (hidden comment: RC0402FR-0710KL)
R210  07 Package: 0603c  09 Parameter 2: 1%  08 Parameter 1: 22R  [RESC1608X55L]  (hidden comment: RC0603FR-0722RL)
R211  07 Package: 0402c  09 Parameter 2: 5%  08 Parameter 1: 100R  [RESC1005X40L]  (hidden comment: 0402WGJ0101TCE)
R212  07 Package: 0603c  09 Parameter 2: 1%  08 Parameter 1: 22R  [RESC1608X55L]  (hidden comment: RC0603FR-0722RL)
R213  07 Package: 0603c  09 Parameter 2: 1%  08 Parameter 1: 22R  [RESC1608X55L]  (hidden comment: RC0603FR-0722RL)
R214  07 Package: 0402c  09 Parameter 2: 1%  08 Parameter 1: 10k  [RESC1005X40L]  (hidden comment: RC0402FR-0710KL)
R215  07 Package: 0402c  09 Parameter 2: 1%  08 Parameter 1: 10k  [RESC1005X40L]  (hidden comment: RC0402FR-0710KL)
R216  07 Package: 0402c  09 Parameter 2: 1%  08 Parameter 1: 10k  [RESC1005X40L]  (hidden comment: RC0402FR-0710KL)
R217  07 Package: 0402c  09 Parameter 2: 1%  08 Parameter 1: 10k  [RESC1005X40L]  (hidden comment: RC0402FR-0710KL)
R218  07 Package: 0402c  09 Parameter 2: 1%  08 Parameter 1: 10k  [RESC1005X40L]  (hidden comment: RC0402FR-0710KL)
R219  07 Package: 0402c  09 Parameter 2: 1%  08 Parameter 1: 10k  [RESC1005X40L]  (hidden comment: RC0402FR-0710KL)
R220  07 Package: 0402c  09 Parameter 2: 1%  08 Parameter 1: 10k  [RESC1005X40L]  (hidden comment: RC0402FR-0710KL)
R221  07 Package: 0402c  09 Parameter 2: 1%  08 Parameter 1: 470R  [RESC1005X40L]  (hidden comment: RC0402FR-07470RL)
R222  07 Package: 0402c  09 Parameter 2: 1%  08 Parameter 1: 10k  [RESC1005X40L]  (hidden comment: RC0402FR-0710KL)
TP200  TESTPAD  [TP 1.2mm]  (value not drawn)  (no BOM)
TP201  TESTPAD  [TP 1.2mm]  (value not drawn)  (no BOM)
U200  07 Package: SOT-23-5  [SOT95P280X145-5L]  (hidden comment: TLV70233DBV)
U201  07 Package: SOT-23-5  [SOT95P280X145-5L]  (hidden comment: TLV70212DBV)
U204  07 Package: QFN-64  [QFN50P900X900X100_HS-65L]  (hidden comment: ZL38063LDG1)  (parts A,B of 2)
U205  07 Package: SOIC-8  [SOIC127P600X175-8L]  (hidden comment: AT25FF041A-SSHN-T)
Y200  07 Package: 3225m  [OSCCC320X250X100L]  (hidden comment: MCSJK-3N-12.00-3.3-50-C)

### Blocks framed on the sheet
3V3 MIC & 1V2 DSP CORE: C200 C203-C205 Q200 R222 U200 U201

### Sub-sheets
Speaker Driver = Audio_SpeakerDriver.SchDoc: AUDIO_AMP_LN (in), AUDIO_AMP_SHD (in), AUDIO_AMP_RN (in), AUDIO_AMP_RP (in), AUDIO_AMP_LP (in)

### Ports
AUDIO_AMP_SHD (in), AUDIO_DSP_BOOT_SEL (in), AUDIO_DSP_I2S1_CLK (out), AUDIO_DSP_I2S1_DI (in), AUDIO_DSP_I2S1_DO (out), AUDIO_DSP_I2S1_FS (out), AUDIO_DSP_IRQ (out), AUDIO_DSP_SPI_CS (in), AUDIO_DSP_SPI_MISO (out), AUDIO_DSP_SPI_MOSI (in), AUDIO_DSP_SPI_SCK (in), ~{AUDIO_DSP_POWER_ENABLE} (in), ~{AUDIO_DSP_RESET} (in)

### Nets
1.2V: C200.2 C211.2 C212.2 C217.2 C218.2 C219.2 U201.5(OUT) U204.4(DVDD12) U204.14(DVDD12) U204.24(DVDD12) U204.42(DVDD12) U204.58(DVDD12)
3.3V: Q200.2(S) R222.2
3.3V MIC: C204.2 C220.2 C221.2 C225.2 C228.2 C229.2 MIC200.5(VDD) MIC201.5(VDD) MIC202.2(SELECT) MIC202.5(VDD) U200.5(OUT) U204.10(AVDD33) U204.11(AVDD33)
3.3V_DSP: C205.2 C208.2 C209.2 C210.2 C213.2 C214.2 C215.2 C216.2 C226.2 C230.2 Q200.3(D) R205.2 R206.2 R215.2 R218.2 R219.2 R220.2 U200.3(EN) U201.1(IN) U204.5(DVDD33) U204.17(EXT_SEL) U204.21(DVDD33) U204.28(DVDD33_XTAL) U204.35(DVDD33) U204.46(DVDD33) U204.51(DVDD33) U204.59(DVDD33) U205.8(VDD) Y200.1(EN) Y200.4(VDD)
5V: C203.2 U200.1(IN)
GND: C200.1 C203.1 C204.1 C205.1 C208.1 C209.1 C210.1 C211.1 C212.1 C213.1 C214.1 C215.1 C216.1 C217.1 C218.1 C219.1 C220.1 C221.1 C222.1 C223.1 C224.1 C225.1 C226.1 C228.1 C229.1 C230.1 MIC200.2(SELECT) MIC200.3(GND) MIC201.2(SELECT) MIC201.3(GND) MIC202.3(GND) R202.1 R208.1 R209.2 R214.2 R216.2 R217.2 R221.1 U200.2(GND) U200.4(NC) U201.2(GND) U201.4(NC) U204.54(VSS) U204.65(EPAD/VSS) U205.4(VSS) Y200.2(GND)
1.2V_ENABLE: U201.3(EN) U204.16(VDD12_CTRL)
~{AUDIO_MEM_CS}: R218.1 U204.64(GPIO_9/SM_CS) U205.1(~{CE})
~{G8/SPI0_CE0}: R206.1 U204.53(~{HCS}) ; port AUDIO_DSP_SPI_CS
~{G16/DSP_RESET}: R202.2 U204.15(~{RESET}) ; port ~{AUDIO_DSP_RESET}
~{G26/DSP_PWR}: Q200.1(G) R222.1 ; port ~{AUDIO_DSP_POWER_ENABLE}
AUDIO_AMP_LN: U204.6(DAC1_M) ; sheet Speaker Driver/AUDIO_AMP_LN
AUDIO_AMP_LP: U204.7(DAC1_P) ; sheet Speaker Driver/AUDIO_AMP_LP
AUDIO_AMP_RN: U204.9(DAC2_M) ; sheet Speaker Driver/AUDIO_AMP_RN
AUDIO_AMP_RP: U204.8(DAC2_P) ; sheet Speaker Driver/AUDIO_AMP_RP
AUDIO_CLK_12MHz: R211.2 R221.2 U204.22(XI)
AUDIO_DSP_I2S1_DI: U204.31(DRA/I2S_SDIA) ; port AUDIO_DSP_I2S1_DI
AUDIO_DSP_IO0: R209.1 U204.33(GPIO_0)
AUDIO_DSP_IO1: R214.1 U204.34(GPIO_1)
AUDIO_DSP_IO2: R215.1 R216.1 U204.36(GPIO_2) ; port AUDIO_DSP_BOOT_SEL  [project net G27/AUDIO_BOOT]
AUDIO_DSP_IO4: R217.1 U204.38(GPIO_4)
AUDIO_DSP_PDM_CLK: MIC200.4(CLK) MIC201.4(CLK) MIC202.4(CLK) R204.1
AUDIO_DSP_PDM_IN1: R210.2 R213.2 U204.19(DMC_IN1)
AUDIO_DSP_PDM_IN2: R212.2 U204.20(DMC_IN2)
AUDIO_MEM_CLK: U204.1(SM_CLK) U205.6(SCK)
AUDIO_MEM_MISO: U204.2(SM_MISO) U205.2(SO)
AUDIO_MEM_MOSI: U204.3(SM_MOSI) U205.5(SI)
G4/AMP_SHD: port AUDIO_AMP_SHD, sheet Speaker Driver/AUDIO_AMP_SHD
G9/SPI0_MISO: R207.1 ; port AUDIO_DSP_SPI_MISO
G10/SPI0_MOSI: U204.55(HDIN) ; port AUDIO_DSP_SPI_MOSI
G11/SPI0_SCK: U204.52(HCLK) ; port AUDIO_DSP_SPI_SCK
G12/DSP_IRQ: R205.1 U204.57(~{HINT}) ; port AUDIO_DSP_IRQ
G18/PCM_CLK: R200.2 R208.2 ; port AUDIO_DSP_I2S1_CLK
G19/PCM_FS: R201.2 ; port AUDIO_DSP_I2S1_FS
G20/PCM_DIN: R203.2 ; port AUDIO_DSP_I2S1_DO
NetC222_2: C222.2 C223.2 U204.13(CREF)
NetC224_2: C224.2 U204.12(CDAC)
NetMIC200_1: MIC200.1(DATA) R210.1
NetMIC201_1: MIC201.1(DATA) R212.1
NetMIC202_1: MIC202.1(DATA) R213.1
NetR200_1: R200.1 U204.29(CLKA/I2S_SCKA)
NetR201_1: R201.1 U204.30(FSA/I2S_WSA)
NetR203_1: R203.1 U204.32(DXA/I2S_SDOA)
NetR204_2: R204.2 U204.18(DMC_CLK)
NetR207_2: R207.2 U204.56(HDOUT)
NetR211_1: R211.1 Y200.3(OUT)
NetR219_1: R219.1 U205.7(~{HOLD})
NetR220_1: R220.1 U205.3(~{WP})
NetTP200_1: TP200.1 U204.49(UART_TX)
NetTP201_1: TP201.1 U204.50(UART_RX)

Not connected (* = marked no-connect by the designer): U204 23(XO)* 25(NC)* 26(NC)* 27(NC)* 37(GPIO_3)* 39(GPIO_5)* 40(GPIO_6)* 41(GPIO_7)* 43(GPIO_8)* 44(GPIO_10)* 45(GPIO_11)* 47(GPIO_12)* 48(GPIO_13)* 60(PCLKB/I2S_SCKB)* 61(FSB/I2S_WSB)* 62(DRB/I2S_SDIB)* 63(DXB/I2S_SD0B)*

### Notes on the sheet
- (near U201) Replacements: MIC5504-3.3YM5 MIC5504-1.2YM5
- Reset can be released only after valid clock stabilization
- Host processor I2S
- 16bit 44100
- DSP in Master Mode
- 1 IN - 1 OUT
- Bootstrap settings
- Master / slave setting in two DSP daisy chain setup
- 1: Boot from external flash
  0: Boot from host
- (near TP201) Optional debug interface
- Version:
- SVN Rev:
- Sheet:
- File:
- Modification Date:
- Variant:
- of
- Sheet Size:
- A3
- SaraAI

### Library data of the parts
C200 C203-C205 = 24: SMT 0603c 1uF 16V 10% X5R 6.9MHz 85'C; 03 Manufacturer: Samsung; 00 Index: 24; 01 Name: CAPACITOR CERAMIC CL10A105KO8NNNC Samsung; 05 Sub Group: CERAMIC; 04 Main Group: CAPACITOR; 06 Assembly: SMT; 12 Parameter 5: 6.9MHz; 13 Parameter 6: 85'C; 14 Modification Date: 16.11.2020; ComponentLink1Description: DATASHEET; ComponentLink1URL: E:\Praca\Mindsailors\Mindsailors Altium\Database Library\Datasheets\CAPACITOR\Samsung CL10A105KO8NNNC.pdf; 02 MPN: CL10A105KO8NNNC; 10 Parameter 3: 10%
C208-C215 C217-C219 C222 C224 = 138: SMT 0402c 100nF 16V 10% X7R 25.8MHz 125'C; 03 Manufacturer: Samsung; 00 Index: 138; 01 Name: CAPACITOR CERAMIC CL05B104KO5NNNC Samsung; 05 Sub Group: CERAMIC; 04 Main Group: CAPACITOR; 06 Assembly: SMT; 12 Parameter 5: 25.8MHz; 13 Parameter 6: 125'C; 14 Modification Date: 16.11.2020; ComponentLink1Description: DATASHEET; ComponentLink1URL: E:\Praca\Mindsailors\Mindsailors Altium\Database Library\Datasheets\CAPACITOR\Samsung CL05B104KO5NNNC.pdf; 02 MPN: CL05B104KO5NNNC; 10 Parameter 3: 10%
C216 C220 C221 C223 C225 C226 C228-C230 = 154: as C100 on sheet Main; 04 Main Group: CAPACITOR; 06 Assembly: SMT; 12 Parameter 5: 10.2MHz; 13 Parameter 6: 85'C; 14 Modification Date: 16.11.2020; ComponentLink1Description: DATASHEET; ComponentLink1URL: E:\Praca\Mindsailors\Mindsailors Altium\Database Library\Datasheets\CAPACITOR\Samsung CL05A105KP5NNNC.pdf; 02 MPN: CL05A105KP5NNNC; 10 Parameter 3: 10%
MIC200-MIC202 = 494: SMT -37dBFS 1.65V - 3.6V 25Hz - 22kHz Omnidirectional; 03 Manufacturer: Knowles; 00 Index: 494; 01 Name: ACOUSTIC MICROPHONE SPH0655LM4H-1 Knowles; 04 Main Group: ACOUSTIC; 05 Sub Group: MICROPHONE; 06 Assembly: SMT; 11 Parameter 4: 25Hz - 22kHz; 13 Parameter 6: Omnidirectional; 14 Modification Date: 08.03.2021; ComponentLink1Description: DATASHEET; ComponentLink1URL: https://www.knowles.com/docs/default-source/default-document-library/sph0655lm4h-1_cornell_ii_datasheet_1.pdf?Status=Master&sfvrsn=663271b1_0; 09 Parameter 2: -37dBFS; 10 Parameter 3: 1.65V - 3.6V; 02 MPN: SPH0655LM4H-1; 07 Package: *
Q200 = 42: SMT SOT-23 P-MOS -20V -2.6A 1.3W; 03 Manufacturer: International Rectifier; 00 Index: 42; 01 Name: TRANSISTOR MOSFET IRLML2246TRPBF International Rectifier; 04 Main Group: TRANSISTOR; 05 Sub Group: MOSFET; Library Directory: sym_basics/; Fotprint Directory: fot_ipc/; 06 Assembly: SMT; 13 Parameter 6: 1.3W; 14 Modification Date: 16.11.2020; ComponentLink1Description: DATASHEET; ComponentLink1URL: E:\Praca\Mindsailors\Mindsailors Altium\Database Library\Datasheets\TRANSISTOR\International Rectifier IRLML2246TRPBF.pdf; 08 Parameter 1: P-MOS; 11 Parameter 4: -20V; 12 Parameter 5: -2.6A; 02 MPN: IRLML2246TRPBF
R200 R201 R203 R204 R207 R210 R212 R213 = 318: as R108 on sheet Main; 04 Main Group: RESISTOR; 06 Assembly: SMT; 11 Parameter 4: 100ppm/K; 12 Parameter 5: 75V; 14 Modification Date: 25.01.2021; ComponentLink1Description: DATASHEET; ComponentLink1URL: https://www.yageo.com/upload/media/product/products/datasheet/rchip/PYu-RC_Group_51_RoHS_L_11.pdf; 10 Parameter 3: 100mW; 02 MPN: RC0603FR-0722RL
R202 R209 R214-R217 = 15: SMT 0402c 10k 1% 62.5mW 100ppm/K 50V; 03 Manufacturer: Yageo; 00 Index: 15; 01 Name: RESISTOR THICK FILM RC0402FR-0710KL Yageo; 05 Sub Group: THICK FILM; Library Directory: sym_basics/; Fotprint Directory: fot_ipc/; 04 Main Group: RESISTOR; 06 Assembly: SMT; 11 Parameter 4: 100ppm/K; 12 Parameter 5: 50V; 14 Modification Date: 16.11.2020; ComponentLink1Description: DATASHEET; ComponentLink1URL: E:\Praca\Mindsailors\Mindsailors Altium\Database Library\Datasheets\RESISTOR\Yageo RC_L Series.pdf; 10 Parameter 3: 62.5mW; 02 MPN: RC0402FR-0710KL
R205 R206 R218-R220 R222 = 15: as R109 on sheet Main; 04 Main Group: RESISTOR; 06 Assembly: SMT; 11 Parameter 4: 100ppm/K; 12 Parameter 5: 50V; 14 Modification Date: 16.11.2020; ComponentLink1Description: DATASHEET; ComponentLink1URL: E:\Praca\Mindsailors\Mindsailors Altium\Database Library\Datasheets\RESISTOR\Yageo RC_L Series.pdf; 10 Parameter 3: 62.5mW; 02 MPN: RC0402FR-0710KL
R208 = 18: SMT 0402c 100k 1% 62.5mW 100ppm/K 50V; 03 Manufacturer: Yageo; 00 Index: 18; 01 Name: RESISTOR THICK FILM RC0402FR-07100KL Yageo; 05 Sub Group: THICK FILM; Library Directory: sym_basics/; Fotprint Directory: fot_ipc/; 04 Main Group: RESISTOR; 06 Assembly: SMT; 11 Parameter 4: 100ppm/K; 12 Parameter 5: 50V; 14 Modification Date: 16.11.2020; ComponentLink1Description: DATASHEET; ComponentLink1URL: E:\Praca\Mindsailors\Mindsailors Altium\Database Library\Datasheets\RESISTOR\Yageo RC_L Series.pdf; 10 Parameter 3: 62.5mW; 02 MPN: RC0402FR-07100KL
R211 = 129: SMT 0402c 100R 5% 62.5mW 200ppm/K 50V; 03 Manufacturer: Royal Ohm; 00 Index: 129; 01 Name: RESISTOR THICK FILM 0402WGJ0101TCE Royal Ohm; 05 Sub Group: THICK FILM; Library Directory: sym_basics/; Fotprint Directory: fot_ipc/; 04 Main Group: RESISTOR; 06 Assembly: SMT; 11 Parameter 4: 200ppm/K; 12 Parameter 5: 50V; 14 Modification Date: 16.11.2020; ComponentLink1Description: DATASHEET; ComponentLink1URL: E:\Praca\Mindsailors\Mindsailors Altium\Database Library\Datasheets\RESISTOR\ROYAL OHM Thick Film Chip Resistors.pdf; 10 Parameter 3: 62.5mW; 02 MPN: 0402WGJ0101TCE
R221 = 21: SMT 0402c 470R 1% 62.5mW 100ppm/K 50V; 03 Manufacturer: Yageo; 00 Index: 21; 01 Name: RESISTOR THICK FILM RC0402FR-07470RL Yageo; 05 Sub Group: THICK FILM; Library Directory: sym_basics/; Fotprint Directory: fot_ipc/; 04 Main Group: RESISTOR; 06 Assembly: SMT; 11 Parameter 4: 100ppm/K; 12 Parameter 5: 50V; 14 Modification Date: 16.11.2020; ComponentLink1Description: DATASHEET; ComponentLink1URL: E:\Praca\Mindsailors\Mindsailors Altium\Database Library\Datasheets\RESISTOR\Yageo RC_L Series.pdf; 10 Parameter 3: 62.5mW; 02 MPN: RC0402FR-07470RL
TP200 TP201 = 10: as TP101 on sheet Main; 02 MPN: TESTPAD; 05 Sub Group: TESTPAD; 14 Modification Date: 16.11.2020
U200 = 479: SMT SOT-23-5 3.3V 5.5V 300mA 375mV; 03 Manufacturer: Texas Instruments; 00 Index: 479; 01 Name: IC VOLTAGE REGULATOR TLV70233DBV Texas Instruments; 04 Main Group: IC; 05 Sub Group: VOLTAGE REGULATOR; 06 Assembly: SMT; 11 Parameter 4: 5.5V; 12 Parameter 5: 300mA; 13 Parameter 6: 375mV; 14 Modification Date: 21.02.2021; ComponentLink1Description: DATASHEET; ComponentLink1URL: https://www.ti.com/lit/ds/symlink/tlv702.pdf?ts=1613945518536&ref_url=https%253A%252F%252Fwww.google.com%252F; 08 Parameter 1: 3.3V; 02 MPN: TLV70233DBV
U201 = 474: SMT SOT-23-5 1.2V 5.5V 300mA 375mV; 03 Manufacturer: Texas Instruments; 00 Index: 474; 01 Name: IC VOLTAGE REGULATOR TLV70212DBV Texas Instruments; 04 Main Group: IC; 05 Sub Group: VOLTAGE REGULATOR; Library Directory: sym_other/; Fotprint Directory: fot_ipc/; 06 Assembly: SMT; 11 Parameter 4: 5.5V; 12 Parameter 5: 300mA; 13 Parameter 6: 375mV; 14 Modification Date: 21.02.2021; ComponentLink1Description: DATASHEET; ComponentLink1URL: https://www.ti.com/lit/ds/symlink/tlv702.pdf?ts=1613945518536&ref_url=https%253A%252F%252Fwww.google.com%252F; 08 Parameter 1: 1.2V; 02 MPN: TLV70212DBV
U204 = 545: SMT QFN-64 Audio DSP and DAC; 03 Manufacturer: Microchip; 00 Index: 545; 01 Name: IC PROCESSOR ZL38063LDG1  Microchip; 04 Main Group: IC; 05 Sub Group: PROCESSOR; Library Directory: sym_other/; Fotprint Directory: fot_ipc/; 06 Assembly: SMT; 11 Parameter 4: Audio DSP and DAC; 14 Modification Date: 06.05.2021; ComponentLink1Description: DATASHEET; ComponentLink1URL: https://www.google.com/url?sa=t&rct=j&q=&esrc=s&source=web&cd=&ved=2ahUKEwijw8HIxrTwAhWvxIsKHU2NBBgQFjABegQIAhAD&url=https%3A%2F%2Fwww.microsemi.com%2Fdocument-portal%2Fdoc_download%2F136798-zl38063-datasheet&usg=AOvVaw2eoUfxAubW_M5spPpwFKjp; 02 MPN: ZL38063LDG1
U205 = 751: SMT SOIC-8 Flash 4Mbit 1.65V - 3.6V SPI; 03 Manufacturer: Adesto; 00 Index: 751; 01 Name: IC MEMORY / AT25FF041A-SSHN-T Adesto; 04 Main Group: IC; 05 Sub Group: MEMORY; Library Directory: sym_other/; Fotprint Directory: fot_ipc/; 06 Assembly: SMT; 11 Parameter 4: 1.65V - 3.6V; 12 Parameter 5: SPI; 14 Modification Date: 02.09.2021; ComponentLink1Description: DATASHEET; ComponentLink1URL: https://pl.mouser.com/datasheet/2/590/at25ff041a-2487492.pdf; 09 Parameter 2: 4Mbit; 08 Parameter 1: Flash; 02 MPN: AT25FF041A-SSHN-T
Y200 = 471: SMT 3225m 12MHz 50ppm; 03 Manufacturer: Multicomp; 00 Index: 471; 01 Name: OSCILLATOR XO MCSJK-3N-12.00-3.3-50-C Multicomp; 05 Sub Group: XO; Library Directory: sym_basics/; Fotprint Directory: fot_ipc/; 04 Main Group: OSCILLATOR; 06 Assembly: SMT; 11 Parameter 4: 50ppm; 14 Modification Date: 19.02.2021; ComponentLink1Description: DATASHEET; ComponentLink1URL: http://www.farnell.com/datasheets/2864171.pdf; 08 Parameter 1: 12MHz; 02 MPN: MCSJK-3N-12.00-3.3-50-C